# Altium project PCB_HIM.PrjPCB
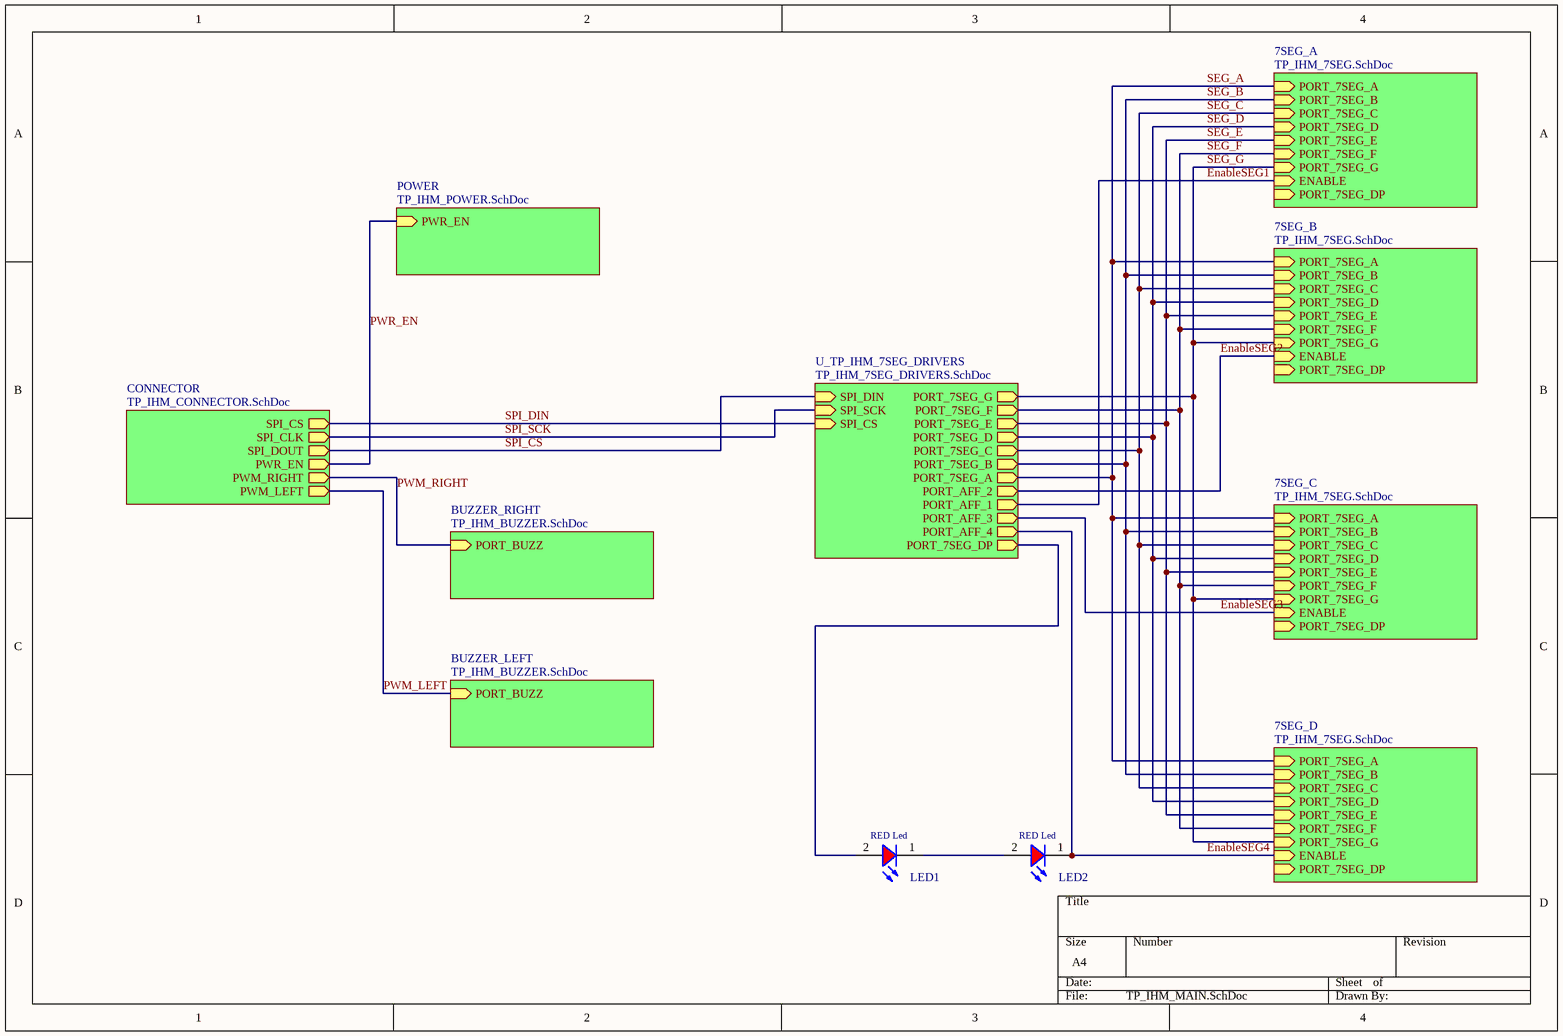
[diagram p0: TP_IHM_MAIN.SchDoc]
6 sheets, 68 parts. Net scope: hierarchical (ports join the sheet entries above them; power ports are global).
Board file: Eurocircuit_6C.PcbDoc
Sheets:
  TP_IHM_MAIN.SchDoc
    BUZZER_RIGHT = TP_IHM_BUZZER.SchDoc
    CONNECTOR = TP_IHM_CONNECTOR.SchDoc
    POWER = TP_IHM_POWER.SchDoc
    BUZZER_LEFT = TP_IHM_BUZZER.SchDoc
    U_TP_IHM_7SEG_DRIVERS = TP_IHM_7SEG_DRIVERS.SchDoc
    7SEG_A = TP_IHM_7SEG.SchDoc
    7SEG_B = TP_IHM_7SEG.SchDoc
    7SEG_C = TP_IHM_7SEG.SchDoc
    7SEG_D = TP_IHM_7SEG.SchDoc

## Sheet TP_IHM_MAIN.SchDoc
size A4

### Parts
LED1  RED Led  [LED_0603_RED]
LED2  RED Led  [LED_0603_RED]

### Sub-sheets
7SEG_A = TP_IHM_7SEG.SchDoc: PORT_7SEG_A (in), PORT_7SEG_B (in), PORT_7SEG_C (in), PORT_7SEG_D (in), PORT_7SEG_E (in), PORT_7SEG_F (in), PORT_7SEG_G (in), ENABLE (in), PORT_7SEG_DP (in)
7SEG_B = TP_IHM_7SEG.SchDoc: PORT_7SEG_A (in), PORT_7SEG_B (in), PORT_7SEG_C (in), PORT_7SEG_D (in), PORT_7SEG_E (in), PORT_7SEG_F (in), PORT_7SEG_G (in), ENABLE (in), PORT_7SEG_DP (in)
7SEG_C = TP_IHM_7SEG.SchDoc: PORT_7SEG_A (in), PORT_7SEG_B (in), PORT_7SEG_C (in), PORT_7SEG_D (in), PORT_7SEG_E (in), PORT_7SEG_F (in), PORT_7SEG_G (in), ENABLE (in), PORT_7SEG_DP (in)
7SEG_D = TP_IHM_7SEG.SchDoc: PORT_7SEG_A (in), PORT_7SEG_B (in), PORT_7SEG_C (in), PORT_7SEG_D (in), PORT_7SEG_E (in), PORT_7SEG_F (in), PORT_7SEG_G (in), ENABLE (in), PORT_7SEG_DP (in)
BUZZER_LEFT = TP_IHM_BUZZER.SchDoc: PORT_BUZZ (in)
BUZZER_RIGHT = TP_IHM_BUZZER.SchDoc: PORT_BUZZ (in)
CONNECTOR = TP_IHM_CONNECTOR.SchDoc: SPI_CS (out), SPI_CLK (out), SPI_DOUT (out), PWR_EN (out), PWM_RIGHT (out), PWM_LEFT (out)
POWER = TP_IHM_POWER.SchDoc: PWR_EN (in)
U_TP_IHM_7SEG_DRIVERS = TP_IHM_7SEG_DRIVERS.SchDoc: PORT_7SEG_G (out), PORT_7SEG_F (out), PORT_7SEG_E (out), PORT_7SEG_D (out), PORT_7SEG_C (out), PORT_7SEG_B (out), PORT_7SEG_A (out), PORT_AFF_2 (out), PORT_AFF_1 (out), PORT_AFF_3 (out), PORT_AFF_4 (out), SPI_DIN (in), SPI_SCK (in), SPI_CS (in), PORT_7SEG_DP (out)

### Nets
EnableSEG1: sheet U_TP_IHM_7SEG_DRIVERS/PORT_AFF_1, sheet 7SEG_A/ENABLE
EnableSEG2: sheet U_TP_IHM_7SEG_DRIVERS/PORT_AFF_2, sheet 7SEG_B/ENABLE
EnableSEG3: sheet U_TP_IHM_7SEG_DRIVERS/PORT_AFF_3, sheet 7SEG_C/ENABLE
EnableSEG4: LED2.1(K) ; sheet U_TP_IHM_7SEG_DRIVERS/PORT_AFF_4, sheet 7SEG_D/ENABLE
PWM_LEFT: sheet CONNECTOR/PWM_LEFT, sheet BUZZER_LEFT/PORT_BUZZ
PWM_RIGHT: sheet BUZZER_RIGHT/PORT_BUZZ, sheet CONNECTOR/PWM_RIGHT
PWR_EN: sheet CONNECTOR/PWR_EN, sheet POWER/PWR_EN
SEG_A: sheet U_TP_IHM_7SEG_DRIVERS/PORT_7SEG_A, sheet 7SEG_A/PORT_7SEG_A, sheet 7SEG_B/PORT_7SEG_A, sheet 7SEG_C/PORT_7SEG_A, sheet 7SEG_D/PORT_7SEG_A
SEG_B: sheet U_TP_IHM_7SEG_DRIVERS/PORT_7SEG_B, sheet 7SEG_A/PORT_7SEG_B, sheet 7SEG_B/PORT_7SEG_B, sheet 7SEG_C/PORT_7SEG_B, sheet 7SEG_D/PORT_7SEG_B
SEG_C: sheet U_TP_IHM_7SEG_DRIVERS/PORT_7SEG_C, sheet 7SEG_A/PORT_7SEG_C, sheet 7SEG_B/PORT_7SEG_C, sheet 7SEG_C/PORT_7SEG_C, sheet 7SEG_D/PORT_7SEG_C
SEG_D: sheet U_TP_IHM_7SEG_DRIVERS/PORT_7SEG_D, sheet 7SEG_A/PORT_7SEG_D, sheet 7SEG_B/PORT_7SEG_D, sheet 7SEG_C/PORT_7SEG_D, sheet 7SEG_D/PORT_7SEG_D
SEG_E: sheet U_TP_IHM_7SEG_DRIVERS/PORT_7SEG_E, sheet 7SEG_A/PORT_7SEG_E, sheet 7SEG_B/PORT_7SEG_E, sheet 7SEG_C/PORT_7SEG_E, sheet 7SEG_D/PORT_7SEG_E
SEG_F: sheet U_TP_IHM_7SEG_DRIVERS/PORT_7SEG_F, sheet 7SEG_A/PORT_7SEG_F, sheet 7SEG_B/PORT_7SEG_F, sheet 7SEG_C/PORT_7SEG_F, sheet 7SEG_D/PORT_7SEG_F
SEG_G: sheet U_TP_IHM_7SEG_DRIVERS/PORT_7SEG_G, sheet 7SEG_A/PORT_7SEG_G, sheet 7SEG_B/PORT_7SEG_G, sheet 7SEG_C/PORT_7SEG_G, sheet 7SEG_D/PORT_7SEG_G
SPI_CS: sheet CONNECTOR/SPI_DOUT, sheet U_TP_IHM_7SEG_DRIVERS/SPI_DIN
SPI_DIN: sheet CONNECTOR/SPI_CS, sheet U_TP_IHM_7SEG_DRIVERS/SPI_CS
SPI_SCK: sheet CONNECTOR/SPI_CLK, sheet U_TP_IHM_7SEG_DRIVERS/SPI_SCK
NetLED1_1: LED1.1(K) LED2.2(A)
NetLED1_2: LED1.2(A) ; sheet U_TP_IHM_7SEG_DRIVERS/PORT_7SEG_DP

### Library data of the parts
LED1 LED2 = LED_RED_SMD_WE_150060RS750x0: LED RED SMD WE 150060RS750x0; ref: 150060RS750x0

## Sheet TP_IHM_BUZZER.SchDoc
size A4
Used 2 times, as channels BUZZER_RIGHT, BUZZER_LEFT. Parts and nets are listed once, with the designators drawn on the sheet.
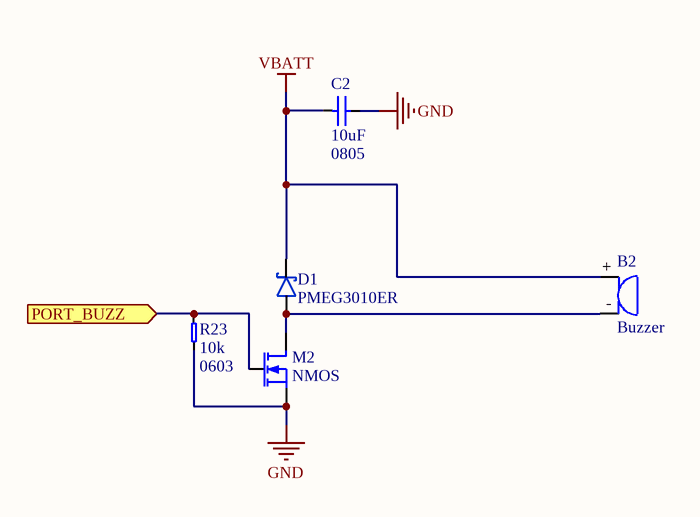
[diagram p1: TP_IHM_BUZZER.SchDoc]

### Parts
B2  Buzzer  [SD160709]
C2  value 10uF  Package: 0805  [0805_CAP_LD]  (hidden comment: CerCap)
D1  PMEG3010ER  [SOD123W]
M2  NMOS  [MOSFET-SOT23]
R23  value 10k  Package: 0603  [0603_RES_LD]  (hidden comment: Resistor)

### Ports
PORT_BUZZ (in)

### Nets
GND: C2.2 M2.S R23.1
VBATT: B2.+ C2.1 D1.K
PORT_BUZZ: M2.G R23.2 ; port PORT_BUZZ
NetB2_-: B2.- D1.A M2.D

### Channels
BUZZER_RIGHT: designators B2=B2.2 C2=C2.2 D1=D2.1 M2=M2.2 R23=R2.23; ports PORT_BUZZ=PWM_RIGHT
BUZZER_LEFT: designators B2=B1.2 C2=C1.2 D1=D1.1 M2=M1.2 R23=R1.23; ports PORT_BUZZ=PWM_LEFT

### Library data of the parts
B2 = SD160709: TDK SD160709 Buzzer; Reference: SD160709
C2 = CerCap: Ceramic Capacitor; Type: *; Voltage/Power: *
D1 = Schottky_PMEG3010ER: Nexperia 1A low Vf Mega Schottky barrier rectifier; Reference: PMEG3010ER
M2 = N-MOSFET: N MOSFET
R23 = Resistor: Precision: *

## Sheet TP_IHM_CONNECTOR.SchDoc
size A4
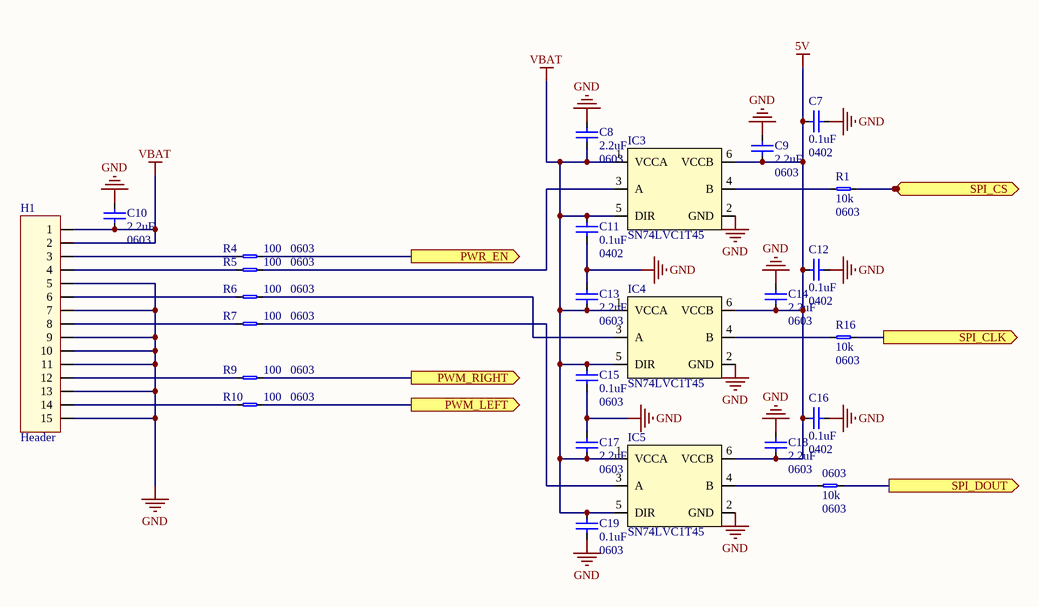
[diagram p2: TP_IHM_CONNECTOR.SchDoc]

### Parts
0603  value 10k  Package: 0603  [0603_RES_LD]  (hidden comment: Resistor)
C7  value 0.1uF  Package: 0402  [0603_CAP_LD]  (hidden comment: CerCap)
C8  value 2.2uF  Package: 0603  [0603_CAP_LD]  (hidden comment: CerCap)
C9  value 2.2uF  Package: 0603  [0603_CAP_LD]  (hidden comment: CerCap)
C10  value 2.2uF  Package: 0603  [0603_CAP_LD]  (hidden comment: CerCap)
C11  value 0.1uF  Package: 0402  [0603_CAP_LD]  (hidden comment: CerCap)
C12  value 0.1uF  Package: 0402  [0603_CAP_LD]  (hidden comment: CerCap)
C13  value 2.2uF  Package: 0603  [0603_CAP_LD]  (hidden comment: CerCap)
C14  value 2.2uF  Package: 0603  [0603_CAP_LD]  (hidden comment: CerCap)
C15  value 0.1uF  Package: 0603  [0603_CAP_LD]  (hidden comment: CerCap)
C16  value 0.1uF  Package: 0402  [0603_CAP_LD]  (hidden comment: CerCap)
C17  value 2.2uF  Package: 0603  [0603_CAP_LD]  (hidden comment: CerCap)
C18  value 2.2uF  Package: 0603  [0603_CAP_LD]  (hidden comment: CerCap)
C19  value 0.1uF  Package: 0603  [0603_CAP_LD]  (hidden comment: CerCap)
H1  Header  [653115131822]
IC3  SN74LVC1T45  [MO-203AB_LD]
IC4  SN74LVC1T45  [MO-203AB_LD]
IC5  SN74LVC1T45  [MO-203AB_LD]
R1  value 10k  Package: 0603  [0603_RES_LD]  (hidden comment: Resistor)
R4  value 100  Package: 0603  [0603_RES_LD]  (hidden comment: Resistor)
R5  value 100  Package: 0603  [0603_RES_LD]  (hidden comment: Resistor)
R6  value 100  Package: 0603  [0603_RES_LD]  (hidden comment: Resistor)
R7  value 100  Package: 0603  [0603_RES_LD]  (hidden comment: Resistor)
R9  value 100  Package: 0603  [0603_RES_LD]  (hidden comment: Resistor)
R10  value 100  Package: 0603  [0603_RES_LD]  (hidden comment: Resistor)
R16  value 10k  Package: 0603  [0603_RES_LD]  (hidden comment: Resistor)

### Ports
PWM_LEFT (out), PWM_RIGHT (out), PWR_EN (out), SPI_CLK (out), SPI_CS (out), SPI_DOUT (out)

### Nets
5V: C7.2 C9.1 C12.2 C14.1 C16.2 C18.1 IC3.6(VCCB) IC4.6(VCCB) IC5.6(VCCB)
GND: C7.1 C8.2 C9.2 C10.2 C11.1 C12.1 C13.2 C14.2 C15.1 C16.1 C17.2 C18.2 C19.1 H1.5 H1.7 H1.9 H1.10 H1.11 H1.13 H1.15 IC3.2(GND) IC4.2(GND) IC5.2(GND)
VBAT: C8.1 C10.1 C11.2 C13.1 C15.2 C17.1 C19.2 H1.1 H1.2 IC3.1(VCCA) IC3.5(DIR) IC4.1(VCCA) IC4.5(DIR) IC5.1(VCCA) IC5.5(DIR)
PWM_LEFT: R10.2 ; port PWM_LEFT
PWM_RIGHT: R9.2 ; port PWM_RIGHT
PWR_EN: R4.2 ; port PWR_EN
SPI_CS: 0603.2 ; port SPI_DOUT
SPI_DIN: R1.2 ; port SPI_CS
SPI_SCK: R16.2 ; port SPI_CLK
Net0603_1: 0603.1 IC5.4(B)
NetH1_3: H1.3 R4.1
NetH1_4: H1.4 R5.1
NetH1_6: H1.6 R6.1
NetH1_8: H1.8 R7.1
NetH1_12: H1.12 R9.1
NetH1_14: H1.14 R10.1
NetIC3_3: IC3.3(A) R5.2
NetIC3_4: IC3.4(B) R1.1
NetIC4_3: IC4.3(A) R6.2
NetIC4_4: IC4.4(B) R16.1
NetIC5_3: IC5.3(A) R7.2

### Library data of the parts
C7-C19 = CerCap: Ceramic Capacitor; Type: *; Voltage/Power: *
H1 = HEADER_15x1: Header 15x1
IC3-IC5 = SN74LVC1T45: Single Bit Dual Supply Buffer
0603 R1 R4-R7 R9 R10 R16 = Resistor: Precision: *

## Sheet TP_IHM_POWER.SchDoc
size A4
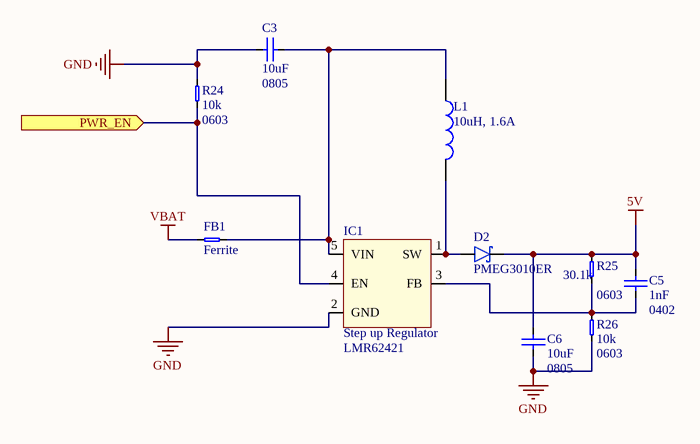
[diagram p3: TP_IHM_POWER.SchDoc]

### Parts
C3  value 10uF  Package: 0805  [0805_CAP_LD]  (hidden comment: CerCap)
C5  value 1nF  Package: 0402  [0402_CAP_LD]  (hidden comment: CerCap)
C6  value 10uF  Package: 0805  [0805_CAP_LD]  (hidden comment: CerCap)
D2  PMEG3010ER  [SOD123W]
FB1  Ferrite  [0603_FER_LD]
IC1  Step up Regulator  [LMR62421]
L1  10uH, 1.6A  [INDUCTOR_WE-LQS_5020]
R24  value 10k  Package: 0603  [0603_RES_LD]  (hidden comment: Resistor)
R25  value 30.1k  Package: 0603  [0603_RES_LD]  (hidden comment: Resistor)
R26  value 10k  Package: 0603  [0603_RES_LD]  (hidden comment: Resistor)

### Ports
PWR_EN (in)

### Nets
5V: C5.1 C6.1 D2.K R25.2
GND: C3.2 C6.2 IC1.2(GND) R24.2 R26.1
VBAT: FB1.2
PWR_EN: IC1.4(EN) R24.1 ; port PWR_EN
NetC3_1: C3.1 FB1.1 IC1.5(VIN) L1.1
NetC5_2: C5.2 IC1.3(FB) R25.1 R26.2
NetD2_A: D2.A IC1.1(SW) L1.2

### Library data of the parts
C3 C5 C6 = CerCap: Ceramic Capacitor; Type: *; Voltage/Power: *
D2 = Schottky_PMEG3010ER: as D1 on sheet TP_IHM_BUZZER; Reference: PMEG3010ER
FB1 = Ferrite: Ferrite Bead
IC1 = LMR62421XMF: LMR62421 simple switcher 24 Vout stepup voltage SOT-23; Reference: LMR62421
L1 = INDUCTOR_74404052100: WE-LQS SMD Power Inductor, size 5020, 10uH, 1.6A; DC Resistance: 109mOhm; Inductance Tolerance: +/-20%; Saturation Current: 1.95A; Self Resonant Frequency: 37MHz; ComponentLink1Description: Manufacturer; ComponentLink1URL: http://www.we-online.de; ComponentLink2Description: Datasheet; ComponentLink2URL: https://katalog.we-online.com/pbs/datasheet/74404052100.pdf; Part Number: 74404052100; Published Date: May 2019; Publisher: Wurth Elektronik; Rated Current: 1.6A; Inductance: 10uH; Operating Temperature: -40 to +125degC; Mounting Technology: SMT; Packaging: Tape and Reel; DC Resistance Tolerance: +/-20%; Size: 5020; Reference: 74404052100
R24-R26 = Resistor: Precision: *

## Sheet TP_IHM_7SEG_DRIVERS.SchDoc: 7SEG DRIVER
size A3
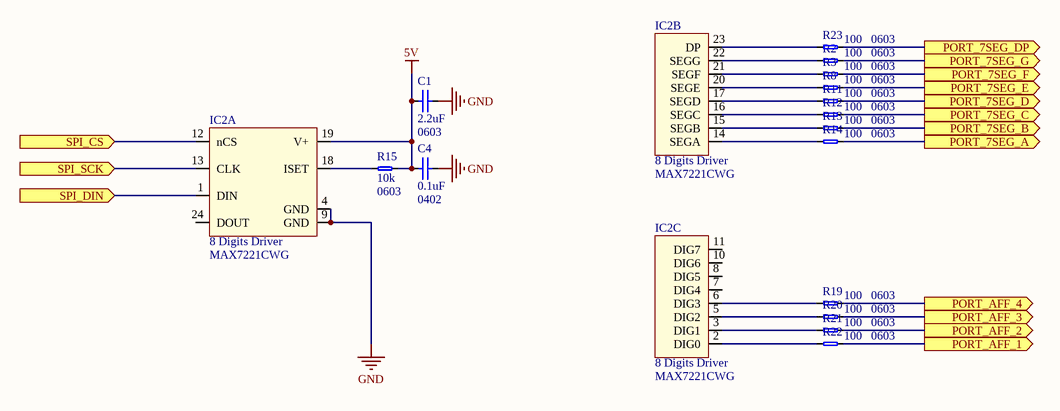
[diagram p4: TP_IHM_7SEG_DRIVERS.SchDoc]

### Parts
C1  value 2.2uF  Package: 0603  [0603_CAP_LD]  (hidden comment: CerCap)
C4  value 0.1uF  Package: 0402  [0603_CAP_LD]  (hidden comment: CerCap)
IC2  8 Digits Driver  [MAX7221CWG]  (parts A,B,C of 3)
R2  value 100  Package: 0603  [0603_RES_LD]  (hidden comment: Resistor)
R3  value 100  Package: 0603  [0603_RES_LD]  (hidden comment: Resistor)
R8  value 100  Package: 0603  [0603_RES_LD]  (hidden comment: Resistor)
R11  value 100  Package: 0603  [0603_RES_LD]  (hidden comment: Resistor)
R12  value 100  Package: 0603  [0603_RES_LD]  (hidden comment: Resistor)
R13  value 100  Package: 0603  [0603_RES_LD]  (hidden comment: Resistor)
R14  value 100  Package: 0603  [0603_RES_LD]  (hidden comment: Resistor)
R15  value 10k  Package: 0603  [0603_RES_LD]  (hidden comment: Resistor)
R19  value 100  Package: 0603  [0603_RES_LD]  (hidden comment: Resistor)
R20  value 100  Package: 0603  [0603_RES_LD]  (hidden comment: Resistor)
R21  value 100  Package: 0603  [0603_RES_LD]  (hidden comment: Resistor)
R22  value 100  Package: 0603  [0603_RES_LD]  (hidden comment: Resistor)
R23  value 100  Package: 0603  [0603_RES_LD]  (hidden comment: Resistor)

### Ports
PORT_7SEG_A (out), PORT_7SEG_B (out), PORT_7SEG_C (out), PORT_7SEG_D (out), PORT_7SEG_DP (out), PORT_7SEG_E (out), PORT_7SEG_F (out), PORT_7SEG_G (out), PORT_AFF_1 (out), PORT_AFF_2 (out), PORT_AFF_3 (out), PORT_AFF_4 (out), SPI_CS (in), SPI_DIN (in), SPI_SCK (in)

### Nets
5V: C1.1 C4.2 IC2.19(V+) R15.1
GND: C1.2 C4.1 IC2.4(GND) IC2.9(GND)
EnableSEG1: R22.1 ; port PORT_AFF_1
EnableSEG2: R21.1 ; port PORT_AFF_2
EnableSEG3: R20.1 ; port PORT_AFF_3
EnableSEG4: R19.1 ; port PORT_AFF_4
SEG_A: R14.1 ; port PORT_7SEG_A
SEG_B: R13.1 ; port PORT_7SEG_B
SEG_C: R12.1 ; port PORT_7SEG_C
SEG_D: R11.1 ; port PORT_7SEG_D
SEG_E: R8.1 ; port PORT_7SEG_E
SEG_F: R3.1 ; port PORT_7SEG_F
SEG_G: R2.1 ; port PORT_7SEG_G
SPI_CS: IC2.1(DIN) ; port SPI_DIN
SPI_DIN: IC2.12(nCS) ; port SPI_CS
SPI_SCK: IC2.13(CLK) ; port SPI_SCK
NetIC2_2: IC2.2(DIG0) R22.2
NetIC2_3: IC2.3(DIG1) R21.2
NetIC2_5: IC2.5(DIG2) R20.2
NetIC2_6: IC2.6(DIG3) R19.2
NetIC2_14: IC2.14(SEGA) R14.2
NetIC2_15: IC2.15(SEGB) R13.2
NetIC2_16: IC2.16(SEGC) R12.2
NetIC2_17: IC2.17(SEGD) R11.2
NetIC2_18: IC2.18(ISET) R15.2
NetIC2_20: IC2.20(SEGE) R8.2
NetIC2_21: IC2.21(SEGF) R3.2
NetIC2_22: IC2.22(SEGG) R2.2
NetIC2_23: IC2.23(DP) R23.2
NetLED1_2: R23.1 ; port PORT_7SEG_DP

Not connected (* = marked no-connect by the designer): IC2 7(DIG4) 8(DIG5) 10(DIG6) 11(DIG7) 24(DOUT)

### Notes on the sheet
- Title
- Size:
- Date:
- A3
- Number:
- Time:
- Revision:
- Sheet
- of
- File:

### Library data of the parts
C1 C4 = CerCap: Ceramic Capacitor; Type: *; Voltage/Power: *
IC2 = MAX7221: MAX7221 8 Digit 7 Segments Display; Reference: MAX7221CWG
R2 R3 R8 R11-R15 R19-R23 = Resistor: Precision: *

## Sheet TP_IHM_7SEG.SchDoc
size A4
Used 4 times, as channels 7SEG_A, 7SEG_B, 7SEG_C, 7SEG_D. Parts and nets are listed once, with the designators drawn on the sheet.
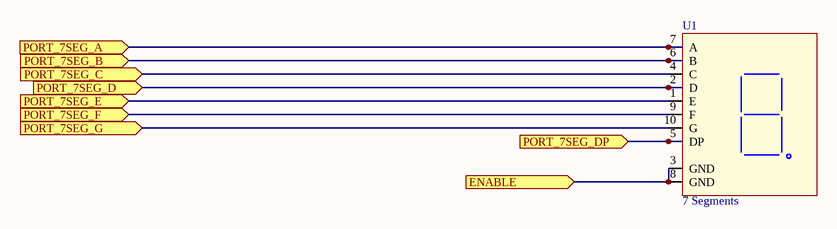
[diagram p5: TP_IHM_7SEG.SchDoc]

### Parts
U1  7 Segments  [SA10-21GWA]

### Ports
ENABLE (in), PORT_7SEG_A (in), PORT_7SEG_B (in), PORT_7SEG_C (in), PORT_7SEG_D (in), PORT_7SEG_DP (in), PORT_7SEG_E (in), PORT_7SEG_F (in), PORT_7SEG_G (in)

### Nets
ENABLE: U1.3(GND) U1.8(GND) ; port ENABLE
PORT_7SEG_A: U1.7(A) ; port PORT_7SEG_A
PORT_7SEG_B: U1.6(B) ; port PORT_7SEG_B
PORT_7SEG_C: U1.4(C) ; port PORT_7SEG_C
PORT_7SEG_D: U1.2(D) ; port PORT_7SEG_D
PORT_7SEG_DP: U1.5(DP) ; port PORT_7SEG_DP
PORT_7SEG_E: U1.1(E) ; port PORT_7SEG_E
PORT_7SEG_F: U1.9(F) ; port PORT_7SEG_F
PORT_7SEG_G: U1.10(G) ; port PORT_7SEG_G

### Channels
7SEG_A: designators end in .1; ports ENABLE=EnableSEG1 PORT_7SEG_A=SEG_A PORT_7SEG_B=SEG_B PORT_7SEG_C=SEG_C PORT_7SEG_D=SEG_D PORT_7SEG_DP=NetU1.1_5 PORT_7SEG_E=SEG_E PORT_7SEG_F=SEG_F PORT_7SEG_G=SEG_G
7SEG_B: designators U1=U2.1; ports ENABLE=EnableSEG2 PORT_7SEG_A=SEG_A PORT_7SEG_B=SEG_B PORT_7SEG_C=SEG_C PORT_7SEG_D=SEG_D PORT_7SEG_DP=NetU2.1_5 PORT_7SEG_E=SEG_E PORT_7SEG_F=SEG_F PORT_7SEG_G=SEG_G
7SEG_C: designators U1=U3.1; ports ENABLE=EnableSEG3 PORT_7SEG_A=SEG_A PORT_7SEG_B=SEG_B PORT_7SEG_C=SEG_C PORT_7SEG_D=SEG_D PORT_7SEG_DP=NetU3.1_5 PORT_7SEG_E=SEG_E PORT_7SEG_F=SEG_F PORT_7SEG_G=SEG_G
7SEG_D: designators U1=U4.1; ports ENABLE=EnableSEG4 PORT_7SEG_A=SEG_A PORT_7SEG_B=SEG_B PORT_7SEG_C=SEG_C PORT_7SEG_D=SEG_D PORT_7SEG_DP=NetU4.1_5 PORT_7SEG_E=SEG_E PORT_7SEG_F=SEG_F PORT_7SEG_G=SEG_G

### Library data of the parts
U1 = SC10-21SRWA: KingBright Led 7 Segments; Reference: SC10-21SRWA

## Nets that join several sheets
5V: TP_IHM_CONNECTOR (9 pins), TP_IHM_POWER (C5.1 C6.1 D2.K R25.2), TP_IHM_7SEG_DRIVERS (C1.1 C4.2 IC2.19 R15.1)
GND: BUZZER_RIGHT (C2.2.2 M2.2.S R2.23.1), TP_IHM_CONNECTOR (23 pins), TP_IHM_POWER (5 pins), BUZZER_LEFT (C1.2.2 M1.2.S R1.23.1), TP_IHM_7SEG_DRIVERS (C1.2 C4.1 IC2.4 IC2.9)
VBAT: TP_IHM_CONNECTOR (15 pins), TP_IHM_POWER (FB1.2)
VBATT: BUZZER_RIGHT (B2.2.+ C2.2.1 D2.1.K), BUZZER_LEFT (B1.2.+ C1.2.1 D1.1.K)
EnableSEG1: TP_IHM_7SEG_DRIVERS (R22.1), 7SEG_A (U1.1.3 U1.1.8)
EnableSEG2: TP_IHM_7SEG_DRIVERS (R21.1), 7SEG_B (U2.1.3 U2.1.8)
EnableSEG3: TP_IHM_7SEG_DRIVERS (R20.1), 7SEG_C (U3.1.3 U3.1.8)
EnableSEG4: TP_IHM_MAIN (LED2.1), TP_IHM_7SEG_DRIVERS (R19.1), 7SEG_D (U4.1.3 U4.1.8)
NetLED1_2: TP_IHM_MAIN (LED1.2), TP_IHM_7SEG_DRIVERS (R23.1)
PWM_LEFT: TP_IHM_CONNECTOR (R10.2), BUZZER_LEFT (M1.2.G R1.23.2)
PWM_RIGHT: BUZZER_RIGHT (M2.2.G R2.23.2), TP_IHM_CONNECTOR (R9.2)
PWR_EN: TP_IHM_CONNECTOR (R4.2), TP_IHM_POWER (IC1.4 R24.1)
SEG_A: TP_IHM_7SEG_DRIVERS (R14.1), 7SEG_A (U1.1.7), 7SEG_B (U2.1.7), 7SEG_C (U3.1.7), 7SEG_D (U4.1.7)
SEG_B: TP_IHM_7SEG_DRIVERS (R13.1), 7SEG_A (U1.1.6), 7SEG_B (U2.1.6), 7SEG_C (U3.1.6), 7SEG_D (U4.1.6)
SEG_C: TP_IHM_7SEG_DRIVERS (R12.1), 7SEG_A (U1.1.4), 7SEG_B (U2.1.4), 7SEG_C (U3.1.4), 7SEG_D (U4.1.4)
SEG_D: TP_IHM_7SEG_DRIVERS (R11.1), 7SEG_A (U1.1.2), 7SEG_B (U2.1.2), 7SEG_C (U3.1.2), 7SEG_D (U4.1.2)
SEG_E: TP_IHM_7SEG_DRIVERS (R8.1), 7SEG_A (U1.1.1), 7SEG_B (U2.1.1), 7SEG_C (U3.1.1), 7SEG_D (U4.1.1)
SEG_F: TP_IHM_7SEG_DRIVERS (R3.1), 7SEG_A (U1.1.9), 7SEG_B (U2.1.9), 7SEG_C (U3.1.9), 7SEG_D (U4.1.9)
SEG_G: TP_IHM_7SEG_DRIVERS (R2.1), 7SEG_A (U1.1.10), 7SEG_B (U2.1.10), 7SEG_C (U3.1.10), 7SEG_D (U4.1.10)
SPI_CS: TP_IHM_CONNECTOR (0603.2), TP_IHM_7SEG_DRIVERS (IC2.1)
SPI_DIN: TP_IHM_CONNECTOR (R1.2), TP_IHM_7SEG_DRIVERS (IC2.12)
SPI_SCK: TP_IHM_CONNECTOR (R16.2), TP_IHM_7SEG_DRIVERS (IC2.13)